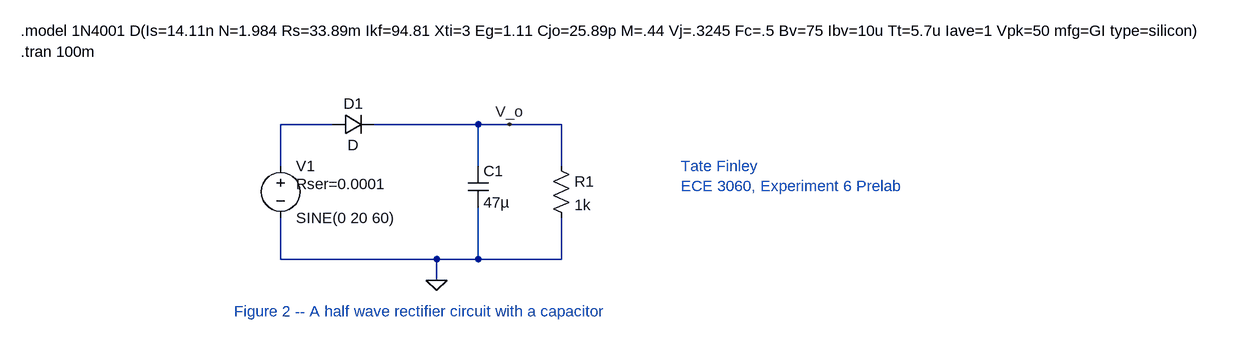
[diagram p0: schematic ECE3060_Lab6cap.asc]
ECE3060_Lab6cap.asc, the LTspice schematic file:
Version 4
SHEET 1 1784 680
WIRE 224 16 144 16
WIRE 448 16 288 16
WIRE 496 16 448 16
WIRE 576 16 496 16
WIRE 144 80 144 16
WIRE 448 80 448 16
WIRE 576 80 576 16
WIRE 144 224 144 160
WIRE 384 224 144 224
WIRE 448 224 448 144
WIRE 448 224 384 224
WIRE 576 224 576 160
WIRE 576 224 448 224
WIRE 384 256 384 224
FLAG 384 256 0
FLAG 496 16 V_o
SYMBOL diode 224 32 R270
WINDOW 0 32 32 VTop 2
WINDOW 3 0 32 VBottom 2
SYMATTR InstName D1
SYMBOL cap 432 80 R0
SYMATTR InstName C1
SYMATTR Value 47µ
SYMBOL res 560 64 R0
SYMATTR InstName R1
SYMATTR Value 1k
SYMBOL voltage 144 64 R0
WINDOW 123 0 0 Left 0
WINDOW 39 24 44 Left 2
SYMATTR SpiceLine Rser=0.0001
SYMATTR InstName V1
SYMATTR Value SINE(0 20 60)
TEXT -256 -96 Left 2 !.tran 100m
TEXT -256 -128 Left 2 !.model 1N4001 D(Is=14.11n N=1.984 Rs=33.89m Ikf=94.81 Xti=3 Eg=1.11 Cjo=25.89p M=.44 Vj=.3245 Fc=.5 Bv=75 Ibv=10u Tt=5.7u Iave=1 Vpk=50 mfg=GI type=silicon)
TEXT 72 304 Left 2 ;Figure 2 -- A half wave rectifier circuit with a capacitor
TEXT 760 80 Left 2 ;Tate Finley\nECE 3060, Experiment 6 Prelab

The netlist it stands for:
* ECE3060_Lab6cap.asc
D1 N001 V_o D
C1 V_o 0 47µ
R1 V_o 0 1k
V1 N001 0 SINE(0 20 60) Rser=0.0001
.model D D
.lib standard.dio
.tran 100m
.model 1N4001 D(Is=14.11n N=1.984 Rs=33.89m Ikf=94.81 Xti=3 Eg=1.11 Cjo=25.89p M=.44 Vj=.3245 Fc=.5 Bv=75 Ibv=10u Tt=5.7u Iave=1 Vpk=50 mfg=GI type=silicon)
* Figure 2 -- A half wave rectifier circuit with a capacitor
* Tate Finley
* ECE 3060, Experiment 6 Prelab
.backanno
.end